# EAGLE design SCHEMAT_WYŚWIETLACZA (EAGLE 9.2.0)

## Sheet 1 of 2
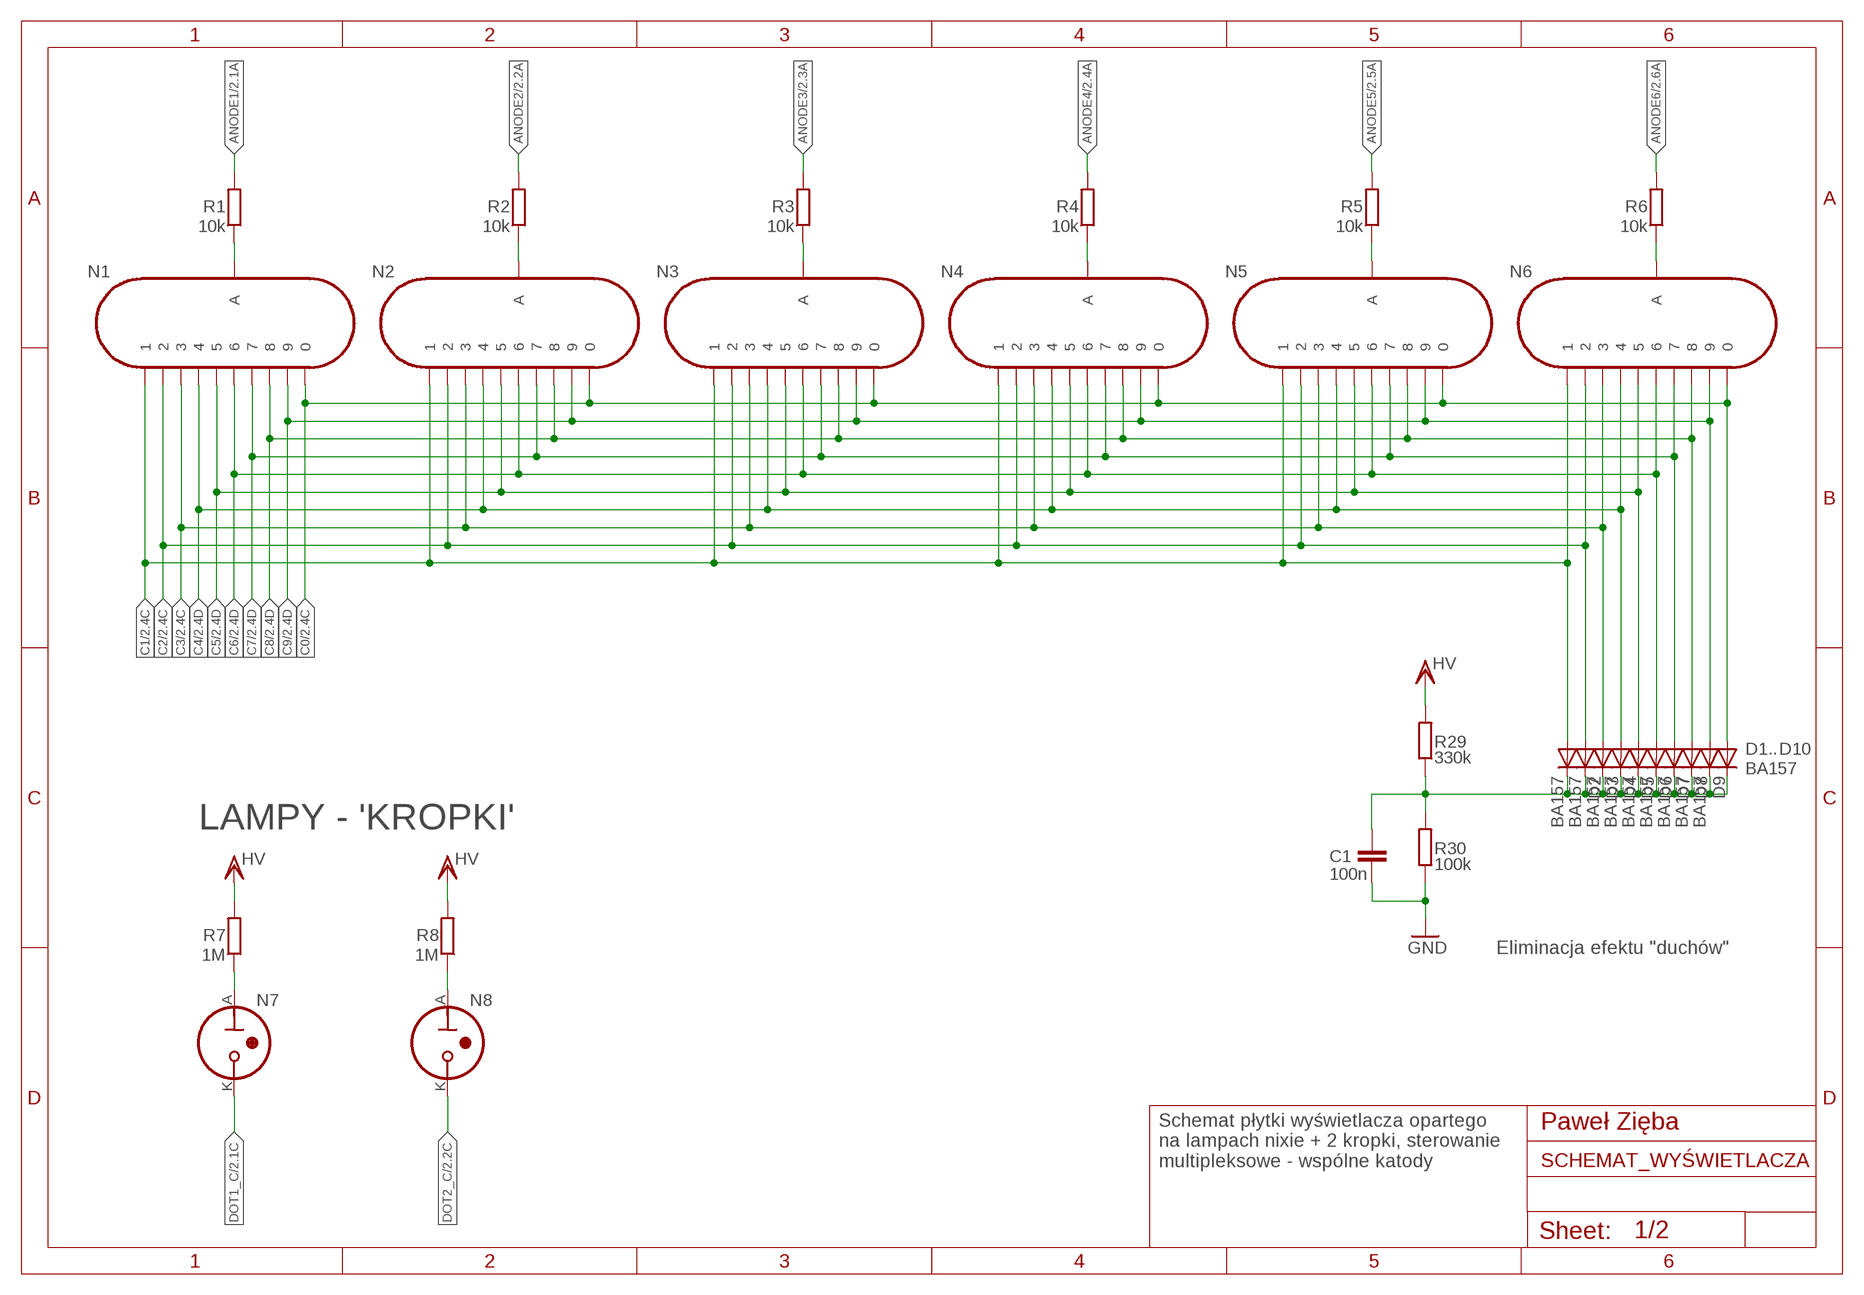
[diagram p0: schematic, sheet 1]

### Parts
C1  100n  C-EU050-045-075  [C50-45-75]
D1  BA157  [P1-10]
D2  BA157  [P1-10]
D3  BA157  [P1-10]
D4  BA157  [P1-10]
D5  BA157  [P1-10]
D6  BA157  [P1-10]
D7  BA157  [P1-10]
D8  BA157  [P1-10]
D9  BA157  [P1-10]
D10  BA157  [P1-10]
N1  IN-8  [IN-8]
N2  IN-8  [IN-8]
N3  IN-8  [IN-8]
N4  IN-8  [IN-8]
N5  IN-8  [IN-8]
N6  IN-8  [IN-8]
N7  IN-3  [IN-3]
N8  IN-3  [IN-3]
R1  10k  R-EU7  [204/7]
R2  10k  R-EU7  [204/7]
R3  10k  R-EU7  [204/7]
R4  10k  R-EU7  [204/7]
R5  10k  R-EU7  [204/7]
R6  10k  R-EU7  [204/7]
R7  1M  R-EU7  [204/7]
R8  1M  R-EU7  [204/7]
R29  330k  R-EU7  [204/7]
R30  100k  R-EU7  [204/7]

### Nets
ANODE1: R1.P$2 ; also sheet 2
ANODE2: R2.P$2 ; also sheet 2
ANODE3: R3.P$2 ; also sheet 2
ANODE4: R4.P$2 ; also sheet 2
ANODE5: R5.P$2 ; also sheet 2
ANODE6: R6.P$2 ; also sheet 2
C0: D10.A N1.0 N2.0 N3.0 N4.0 N5.0 N6.0 ; also sheet 2
C1: D1.A N1.1 N2.1 N3.1 N4.1 N5.1 N6.1 ; also sheet 2
C2: D2.A N1.2 N2.2 N3.2 N4.2 N5.2 N6.2 ; also sheet 2
C3: D3.A N1.3 N2.3 N3.3 N4.3 N5.3 N6.3 ; also sheet 2
C4: D4.A N1.4 N2.4 N3.4 N4.4 N5.4 N6.4 ; also sheet 2
C5: D5.A N1.5 N2.5 N3.5 N4.5 N5.5 N6.5 ; also sheet 2
C6: D6.A N1.6 N2.6 N3.6 N4.6 N5.6 N6.6 ; also sheet 2
C7: D7.A N1.7 N2.7 N3.7 N4.7 N5.7 N6.7 ; also sheet 2
C8: D8.A N1.8 N2.8 N3.8 N4.8 N5.8 N6.8 ; also sheet 2
C9: D9.A N1.9 N2.9 N3.9 N4.9 N5.9 N6.9 ; also sheet 2
DOT1_C: N7.K ; also sheet 2
DOT2_C: N8.K ; also sheet 2
GND: C1.P$2 R30.P$1 ; also sheet 2
HV: R7.P$2 R8.P$2 R29.P$2 ; also sheet 2
N$1: N7.A R7.P$1
N$2: N8.A R8.P$1
N$31: N1.A R1.P$1
N$32: C1.P$1 D1.C D2.C D3.C D4.C D5.C D6.C D7.C D8.C D9.C D10.C R29.P$1 R30.P$2
N$33: N2.A R2.P$1
N$34: N3.A R3.P$1
N$35: N5.A R5.P$1
N$36: N4.A R4.P$1
N$37: N6.A R6.P$1

### Notes on the sheet
- ..
- LAMPY - 'KROPKI'
- Eliminacja efektu "duchów"
- Paweł Zięba
- Schemat płytki wyświetlacza opartego 
  na lampach nixie + 2 kropki, sterowanie
  multipleksowe - wspólne katody

## Sheet 2 of 2
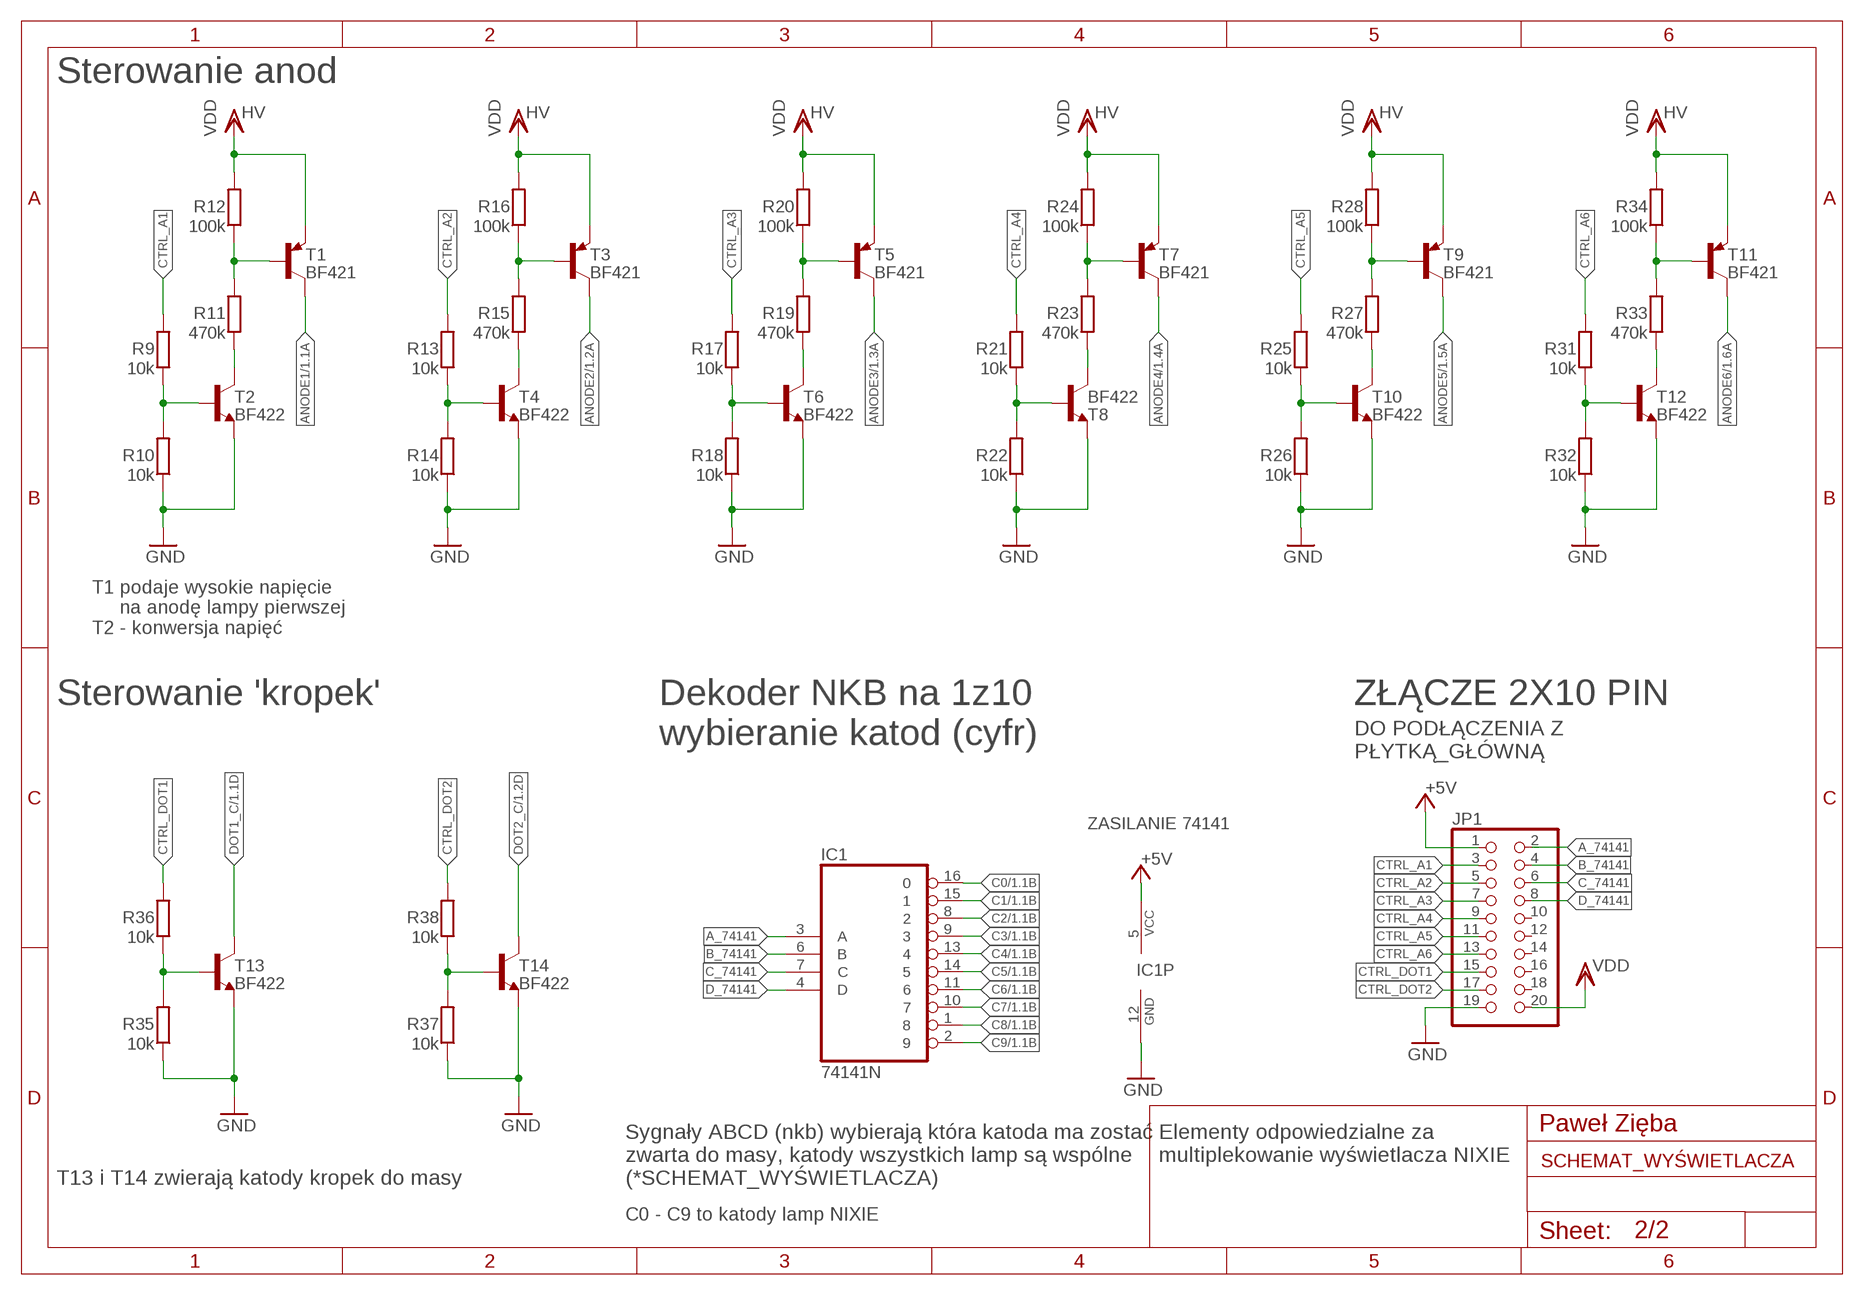
[diagram p1: schematic, sheet 2]

### Parts
IC1  74141N  [DIL16]
JP1  PINHD-2X10  [2X10]
R9  10k  R-EU7  [204/7]
R10  10k  R-EU7  [204/7]
R11  470k  R-EU7  [204/7]
R12  100k  R-EU7  [204/7]
R13  10k  R-EU7  [204/7]
R14  10k  R-EU7  [204/7]
R15  470k  R-EU7  [204/7]
R16  100k  R-EU7  [204/7]
R17  10k  R-EU7  [204/7]
R18  10k  R-EU7  [204/7]
R19  470k  R-EU7  [204/7]
R20  100k  R-EU7  [204/7]
R21  10k  R-EU7  [204/7]
R22  10k  R-EU7  [204/7]
R23  470k  R-EU7  [204/7]
R24  100k  R-EU7  [204/7]
R25  10k  R-EU7  [204/7]
R26  10k  R-EU7  [204/7]
R27  470k  R-EU7  [204/7]
R28  100k  R-EU7  [204/7]
R31  10k  R-EU7  [204/7]
R32  10k  R-EU7  [204/7]
R33  470k  R-EU7  [204/7]
R34  100k  R-EU7  [204/7]
R35  10k  R-EU7  [204/7]
R36  10k  R-EU7  [204/7]
R37  10k  R-EU7  [204/7]
R38  10k  R-EU7  [204/7]
T1  BF421  [TO92-BCE]
T2  BF422  BF422-NPN-TO92-BCE  [TO92-BCE]
T3  BF421  [TO92-BCE]
T4  BF422  BF422-NPN-TO92-BCE  [TO92-BCE]
T5  BF421  [TO92-BCE]
T6  BF422  BF422-NPN-TO92-BCE  [TO92-BCE]
T7  BF421  [TO92-BCE]
T8  BF422  BF422-NPN-TO92-BCE  [TO92-BCE]
T9  BF421  [TO92-BCE]
T10  BF422  BF422-NPN-TO92-BCE  [TO92-BCE]
T11  BF421  [TO92-BCE]
T12  BF422  BF422-NPN-TO92-BCE  [TO92-BCE]
T13  BF422  BF422-NPN-TO92-BCE  [TO92-BCE]
T14  BF422  BF422-NPN-TO92-BCE  [TO92-BCE]

### Nets
+5V: IC1.5(VCC) JP1.1
A_74141: IC1.3(A) JP1.2
ANODE1: T1.C ; also sheet 1
ANODE2: T3.C ; also sheet 1
ANODE3: T5.C ; also sheet 1
ANODE4: T7.C ; also sheet 1
ANODE5: T9.C ; also sheet 1
ANODE6: T11.C ; also sheet 1
B_74141: IC1.6(B) JP1.4
C0: IC1.16 ; also sheet 1
C1: IC1.15 ; also sheet 1
C2: IC1.8 ; also sheet 1
C3: IC1.9 ; also sheet 1
C4: IC1.13 ; also sheet 1
C5: IC1.14 ; also sheet 1
C6: IC1.11 ; also sheet 1
C7: IC1.10 ; also sheet 1
C8: IC1.1 ; also sheet 1
C9: IC1.2 ; also sheet 1
C_74141: IC1.7(C) JP1.6
CTRL_A1: JP1.3 R9.P$2
CTRL_A2: JP1.5 R13.P$2
CTRL_A3: JP1.7 R17.P$2
CTRL_A4: JP1.9 R21.P$2
CTRL_A5: JP1.11 R25.P$2
CTRL_A6: JP1.13 R31.P$2
CTRL_DOT1: JP1.15 R36.P$2
CTRL_DOT2: JP1.17 R38.P$2
D_74141: IC1.4(D) JP1.8
DOT1_C: T13.C ; also sheet 1
DOT2_C: T14.C ; also sheet 1
GND: IC1.12(GND) JP1.19 R10.P$1 R14.P$1 R18.P$1 R22.P$1 R26.P$1 R32.P$1 R35.P$1 R37.P$1 T2.E T4.E T6.E T8.E T10.E T12.E T13.E T14.E ; also sheet 1
HV: JP1.20 R12.P$2 R16.P$2 R20.P$2 R24.P$2 R28.P$2 R34.P$2 T1.E T3.E T5.E T7.E T9.E T11.E ; supply symbol labelled VDD ; also sheet 1
N$3: R9.P$1 R10.P$2 T2.B
N$4: R11.P$1 T2.C
N$5: R11.P$2 R12.P$1 T1.B
N$6: R13.P$1 R14.P$2 T4.B
N$7: R15.P$1 T4.C
N$8: R15.P$2 R16.P$1 T3.B
N$9: R17.P$1 R18.P$2 T6.B
N$10: R19.P$1 T6.C
N$11: R19.P$2 R20.P$1 T5.B
N$12: R21.P$1 R22.P$2 T8.B
N$13: R23.P$1 T8.C
N$14: R23.P$2 R24.P$1 T7.B
N$15: R25.P$1 R26.P$2 T10.B
N$16: R27.P$1 T10.C
N$17: R27.P$2 R28.P$1 T9.B
N$18: R31.P$1 R32.P$2 T12.B
N$19: R33.P$1 T12.C
N$20: R33.P$2 R34.P$1 T11.B
N$21: R35.P$2 R36.P$1 T13.B
N$22: R37.P$2 R38.P$1 T14.B
Unconnected: JP1.10 JP1.12 JP1.14 JP1.16 JP1.18

### Notes on the sheet
- Sterowanie anod
- T1 podaje wysokie napięcie 
       na anodę lampy pierwszej 
  T2 - konwersja napięć
- Dekoder NKB na 1z10
  wybieranie katod (cyfr)
- Sterowanie 'kropek' | ZŁĄCZE 2X10 PIN
- DO PODŁĄCZENIA Z
  PŁYTKĄ_GŁÓWNĄ
- ZASILANIE 74141
- Paweł Zięba
- T13 i T14 zwierają katody kropek do masy
- Sygnały ABCD (nkb) wybierają która katoda ma zostać 
  zwarta do masy, katody wszystkich lamp są wspólne
  (*SCHEMAT_WYŚWIETLACZA)
- Elementy odpowiedzialne za 
  multiplekowanie wyświetlacza NIXIE
- C0 - C9 to katody lamp NIXIE

## Library data of the parts
C1 = RCL!:C-EU
D1-D10 = diode:BA157: DIODE fast soft-recovery controlled avalanche rectifier
IC1 = 74xx-us:74*141: BCD to decimal DECODER/DRIVER
JP1 = pinhead:PINHD-2X10: PIN HEADER
N1-N6 = russian-nixies:IN-8: IN-8: medium numeric frontview nixie tube
N7 N8 = russian-nixies:IN-3: IN-3: nixie bulb
R1-R38 = RCL!:R-EU
T1 T3 T5 T7 T9 T11 = transistor-pnp:BF421*: PNP Transistror
T2 T4 T6 T8 T10 T12-T14 = transistor:*-NPN-: NPN Transistror BF959 corrected 2008.03.06

## Board
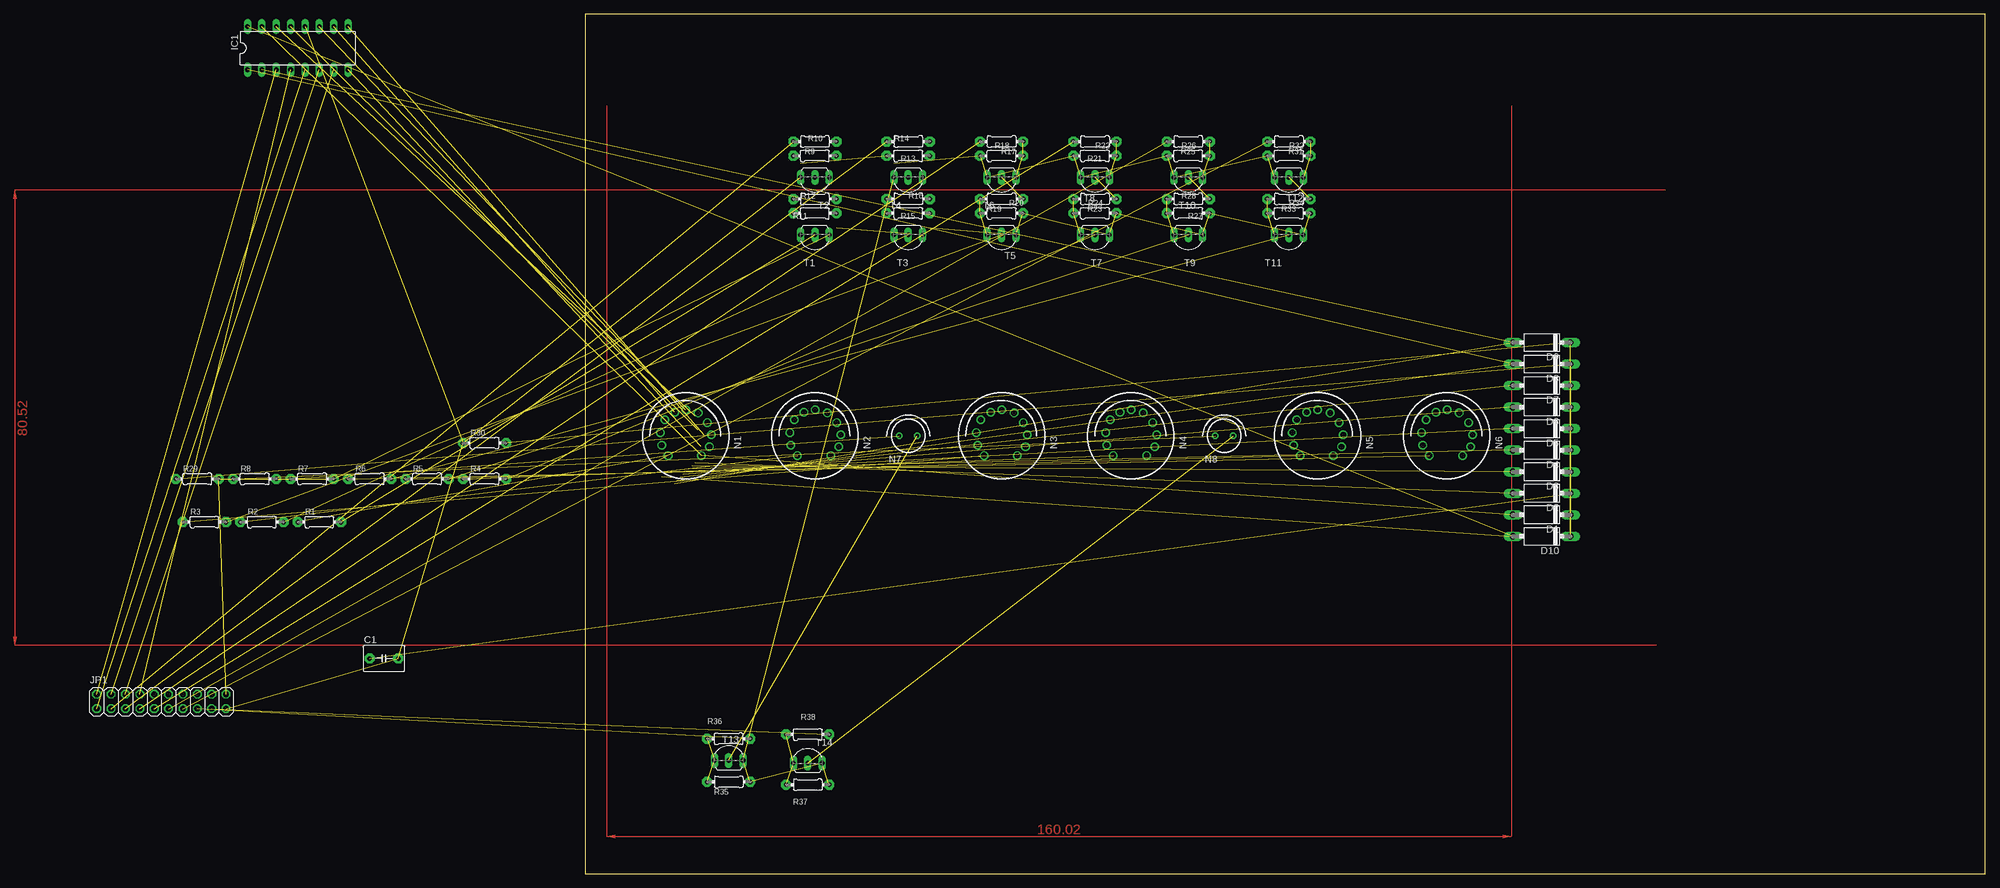
[diagram p2: board, top side]
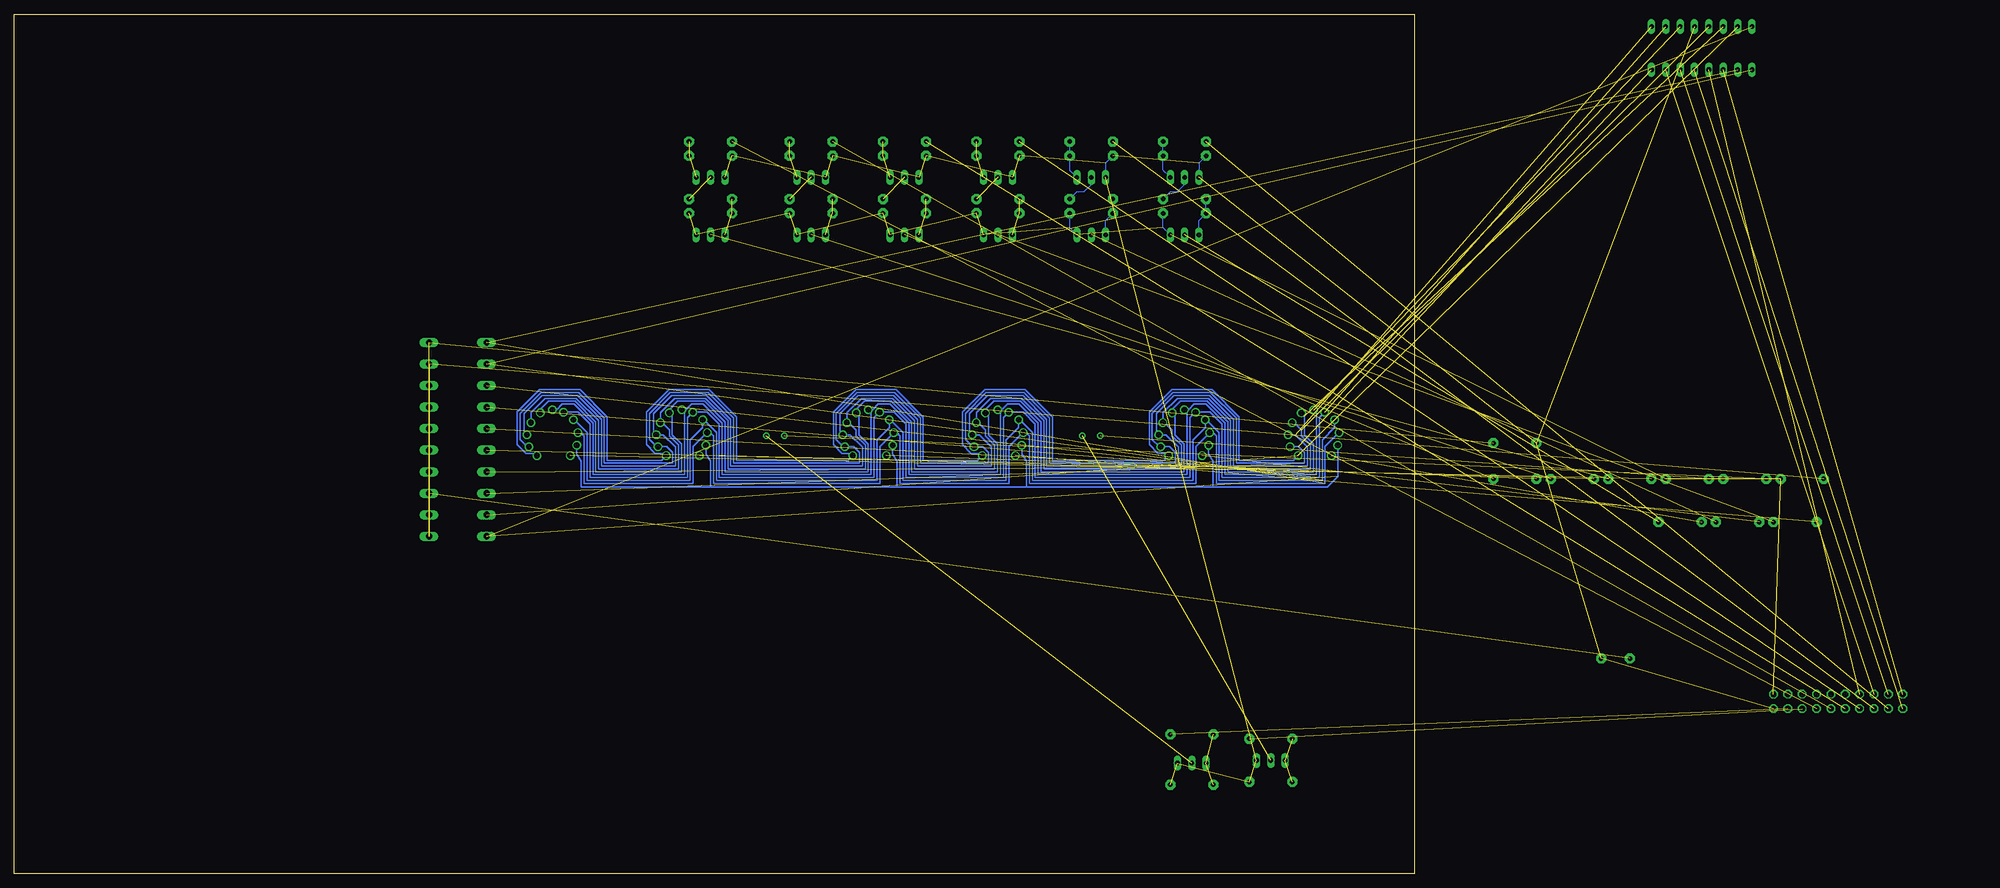
[diagram p3: board, bottom side, seen from below]

Size 247.63 x 152.07 mm. Coordinates in mm from the lower left corner, seen from the top.
Outline: 0,0 247.63,0 247.63,152.07 0,152.07 0,0
Copper layers (1*16): Top 0.035mm / dielectric 1.5mm / Bottom 0.035mm
Design rules "default *": minimum track width 6mil, minimum drill 0.35mm, track to track 8mil, track to pad 8mil, pad to pad 8mil, via to via 8mil, smd to smd 6mil, copper to edge 40mil, drill to drill 6mil, minimum pad ring 10mil, minimum via ring 8mil, stop-mask expansion 4mil, vias tented up to drill 0mil, thermal gap 10mil

### Footprints (pad centres in the part's own frame; a part is rotated, then mirrored left to right if it is on the bottom)
C50-45-75 = drill 0.8 pad 1.778 octagon: P$1 -2.54,0; P$2 2.54,0
P1-10 = drill 1.118 long: A 5.08,0; C -5.08,0
DIL16 = drill 0.813 long: 1 -8.89,-3.81; 2 -6.35,-3.81; 3 -3.81,-3.81; 4 -1.27,-3.81; 5 1.27,-3.81; 6 3.81,-3.81; 7 6.35,-3.81; 8 8.89,-3.81; 9 8.89,3.81; 10 6.35,3.81; 11 3.81,3.81; 12 1.27,3.81; 13 -1.27,3.81; 14 -3.81,3.81; 15 -6.35,3.81; 16 -8.89,3.81
2X10 = drill 1.016 octagon: 1 -11.43,-1.27; 2 -11.43,1.27; 3 -8.89,-1.27; 4 -8.89,1.27; 5 -6.35,-1.27; 6 -6.35,1.27; 7 -3.81,-1.27; 8 -3.81,1.27; 9 -1.27,-1.27; 10 -1.27,1.27; 11 1.27,-1.27; 12 1.27,1.27; 13 3.81,-1.27; 14 3.81,1.27; 15 6.35,-1.27; 16 6.35,1.27; 17 8.89,-1.27; 18 8.89,1.27; 19 11.43,-1.27; 20 11.43,1.27
IN-8 = drill 1: 0 -4.244,-1.655; 1 2.792,-3.483; 2 4.222,-1.907; 3 4.556,0.189; 4 3.837,2.348; 5 2.203,4.052; 6 0.034,4.603; 7 -1.928,4.186; 8 -3.666,2.83; 9 -4.461,0.584; A -3.101,-3.49
IN-3 = drill 0.6 octagon: A -1.587,0; K 1.587,0
204/7 = drill 0.8 pad 1.778 octagon: P$1 -3.81,0; P$2 3.81,0
TO92-BCE = drill 0.813 long: B 2.54,0; C 0,0; E -2.54,0
TO92-BCE' = drill 0.813 long: B -2.54,0; C 0,0; E 2.54,0

### Placement (x,y rotation side)
C1  -35.56,38.1 0 top  (outside the outline)
D1  169.16,63.5 180 top
D2  169.16,67.31 180 top
D3  169.16,71.12 180 top
D4  169.16,74.93 180 top
D5  169.16,78.74 180 top
D6  169.16,82.55 180 top
D7  169.16,86.36 180 top
D8  169.16,90.17 180 top
D9  169.16,93.98 180 top
D10  169.16,59.69 180 top
IC1  -50.8,146.05 0 top  (outside the outline)
JP1  -74.93,30.48 0 top  (outside the outline)
N1  17.78,77.47 0 top
N2  40.64,77.47 0 top
N3  73.66,77.47 0 top
N4  96.52,77.47 0 top
N5  129.54,77.47 0 top
N6  152.4,77.47 0 top
N7  57.15,77.47 0 top
N8  113.03,77.47 0 top
R1  -46.99,62.23 0 top  (outside the outline)
R2  -57.15,62.23 0 top  (outside the outline)
R3  -67.31,62.23 0 top  (outside the outline)
R4  -17.78,69.85 0 top  (outside the outline)
R5  -27.94,69.85 0 top  (outside the outline)
R6  -38.1,69.85 0 top  (outside the outline)
R7  -48.26,69.85 0 top  (outside the outline)
R8  -58.42,69.85 0 top  (outside the outline)
R9  40.64,129.54 180 top
R10  40.64,127 0 top
R11  40.64,119.38 180 top
R12  40.64,116.84 0 top
R13  57.15,129.54 180 top
R14  57.15,127 0 top
R15  57.15,119.38 180 top
R16  57.15,116.84 0 top
R17  73.66,129.54 180 top
R18  73.66,127 0 top
R19  73.66,119.38 180 top
R20  73.66,116.84 0 top
R21  90.17,129.54 180 top
R22  90.17,127 0 top
R23  90.17,119.38 180 top
R24  90.17,116.84 0 top
R25  106.68,129.54 180 top
R26  106.68,127 0 top
R27  106.68,119.38 180 top
R28  106.68,116.84 0 top
R29  -68.58,69.85 0 top  (outside the outline)
R30  -17.78,76.2 0 top  (outside the outline)
R31  124.46,129.54 180 top
R32  124.46,127 0 top
R33  124.46,119.38 180 top
R34  124.46,116.84 0 top
R35  25.4,16.26 180 top
R36  25.4,23.88 0 top
R37  39.37,15.75 180 top
R38  39.37,24.64 0 top
T1  40.64,113.03 180 top
T2  BF422  [TO92-BCE']  40.64,123.19 180 top
T3  57.15,113.03 180 top
T4  BF422  [TO92-BCE']  57.15,123.19 180 top
T5  73.66,113.03 180 top
T6  BF422  [TO92-BCE']  73.66,123.19 180 top
T7  90.17,113.03 180 top
T8  BF422  [TO92-BCE']  90.17,123.19 180 top
T9  106.68,113.03 180 top
T10  BF422  [TO92-BCE']  106.68,123.19 180 top
T11  124.46,113.03 180 top
T12  BF422  [TO92-BCE']  124.46,123.19 180 top
T13  BF422  [TO92-BCE']  25.4,20.07 0 top
T14  BF422  [TO92-BCE']  39.37,19.56 0 top

### Tracks (layer width: path | path; a pad name or v marks a point on that pad's centre or on a via)
+5V  (1 unrouted)
A_74141  (1 unrouted)
ANODE1  (1 unrouted)
ANODE2  (1 unrouted)
ANODE3  (1 unrouted)
ANODE4  (1 unrouted)
ANODE5  (1 unrouted)
ANODE6  (1 unrouted)
B_74141  (1 unrouted)
C0  (2 unrouted)
  Bottom 0.305: 35.6,68.45 35.6,73.03 36.4,74.26 | 36.4,74.26 N2.0 | 35.6,68.45 15.37,68.45 13.51,70.31 13.51,75.79 N1.0 | 91.48,68.45 91.48,73.03 92.28,74.26 N4.0 | 91.48,68.45 68.62,68.45 | 69.39,75.79 N3.0 69.42,74.26 68.62,73.03 68.62,68.45 | N6.0 148.16,74.26 147.36,73.03 147.36,68.45 124.5,68.45 | 125.27,75.79 N5.0 125.3,74.26 124.5,73.03 124.5,68.45 | 68.62,68.45 35.6,68.45 | 36.4,74.26 36.37,74.23 36.37,74.22 36.36,74.2 | 91.48,68.45 124.5,68.45
C1  (2 unrouted)
  Bottom 0.305: N1.1 21.41,73.15 30.99,73.15 30.99,80.8 35.82,85.63 42.91,85.63 46.88,81.66 46.88,75.92 45.35,74.38 43.83,74.38 N2.1 44.27,73.15 64.01,73.15 64.01,80.8 68.84,85.63 75.93,85.63 79.91,81.66 79.91,75.92 78.37,74.38 76.85,74.38 N3.1 77.29,73.15 86.87,73.15 86.87,80.8 91.7,85.63 98.79,85.63 102.77,81.66 102.77,75.92 101.23,74.38 99.71,74.38 N4.1 100.15,73.15 119.89,73.15 119.89,80.8 124.72,85.63 131.81,85.63 135.78,81.66 135.78,75.92 134.25,74.38 132.73,74.38 N5.1 133.17,73.15 142.75,73.15 142.75,80.8 147.58,85.63 154.67,85.63 158.65,81.66 158.65,75.92 157.11,74.38 155.59,74.38 N6.1
C2  (2 unrouted)
  Bottom 0.305: N1.2 20.48,75.56 19.43,74.52 19.43,72.64 31.5,72.64 31.5,80.59 36.03,85.12 42.7,85.12 46.38,81.44 46.38,76.81 45.13,75.56 N2.2 43.34,75.56 42.29,74.52 42.29,72.64 64.52,72.64 64.52,80.59 69.05,85.12 75.72,85.12 79.4,81.44 79.4,76.81 78.15,75.56 N3.2 76.36,75.56 75.31,74.52 75.31,72.64 87.38,72.64 87.38,80.59 91.91,85.12 98.58,85.12 102.26,81.44 102.26,76.81 101.01,75.56 N4.2 99.22,75.56 98.17,74.52 98.17,72.64 120.4,72.64 120.4,80.59 124.93,85.12 131.6,85.12 135.28,81.44 135.28,76.81 134.03,75.56 N5.2 132.24,75.56 131.19,74.52 131.19,72.64 143.26,72.64 143.26,80.59 147.79,85.12 154.46,85.12 158.14,81.44 158.14,76.81 156.89,75.56 N6.2
C3  (2 unrouted)
  Bottom 0.305: N1.3 21.07,77.66 18.9,75.49 18.9,72.14 32,72.14 32,80.38 36.24,84.61 42.49,84.61 45.66,81.44 45.66,78.12 N2.3 43.93,77.66 41.76,75.49 41.76,72.14 65.02,72.14 65.02,80.38 69.26,84.61 75.51,84.61 78.68,81.44 78.68,78.12 N3.3 76.95,77.66 74.78,75.49 74.78,72.14 87.88,72.14 87.88,80.38 92.12,84.61 98.37,84.61 101.54,81.44 101.54,78.12 N4.3 99.81,77.66 97.64,75.49 97.64,72.14 120.9,72.14 120.9,80.38 125.14,84.61 131.39,84.61 134.56,81.44 134.56,78.12 N5.3 132.83,77.66 130.66,75.49 130.66,72.14 143.76,72.14 143.76,80.38 148,84.61 154.25,84.61 157.42,81.44 157.42,78.12 N6.3
C4  (2 unrouted)
  Bottom 0.305: N1.4 21.32,79.82 19.98,78.48 19.98,77.43 18.36,75.81 18.36,71.63 32.51,71.63 32.51,80.17 36.45,84.11 41.93,84.11 44.45,81.58 44.45,79.84 N2.4 44.18,79.82 42.84,78.48 42.84,77.43 41.22,75.81 41.22,71.63 65.53,71.63 65.53,80.17 69.47,84.11 74.95,84.11 77.47,81.58 77.47,79.84 N3.4 77.2,79.82 75.86,78.48 75.86,77.43 74.24,75.81 74.24,71.63 88.39,71.63 88.39,80.17 92.33,84.11 97.81,84.11 100.33,81.58 100.33,79.84 N4.4 100.06,79.82 98.72,78.48 98.72,77.43 97.1,75.81 97.1,71.63 121.41,71.63 121.41,80.17 125.35,84.11 130.83,84.11 133.35,81.58 133.35,79.84 N5.4 133.08,79.82 131.74,78.48 131.74,77.43 130.12,75.81 130.12,71.63 144.27,71.63 144.27,80.17 148.21,84.11 153.69,84.11 156.21,81.58 156.21,79.84 N6.4
C5  (2 unrouted)
  Bottom 0.305: N1.5 19.48,81.01 19.48,77.64 17.86,76.02 17.86,71.12 33.02,71.12 33.02,79.96 36.66,83.6 41.37,83.6 42.84,82.12 N2.5 42.34,81.01 42.34,77.64 40.72,76.02 40.72,71.12 66.04,71.12 66.04,79.96 69.68,83.6 74.39,83.6 75.86,82.12 N3.5 75.36,81.01 75.36,77.64 73.74,76.02 73.74,71.12 88.9,71.12 88.9,79.96 92.54,83.6 97.25,83.6 98.72,82.12 N4.5 98.22,81.01 98.22,77.64 96.6,76.02 96.6,71.12 121.92,71.12 121.92,79.96 125.56,83.6 130.27,83.6 131.74,82.12 N5.5 131.24,81.01 131.24,77.64 129.62,76.02 129.62,71.12 144.78,71.12 144.78,79.96 148.42,83.6 153.13,83.6 154.6,82.12 N6.5
C6  (2 unrouted)
  Bottom 0.305: N1.6 17.33,81.59 17.33,70.61 33.53,70.61 33.53,79.75 36.87,83.09 38.95,83.09 39.96,82.07 N2.6 40.19,81.59 40.19,70.61 66.55,70.61 66.55,79.75 69.89,83.09 71.97,83.09 72.98,82.07 N3.6 73.21,81.59 73.21,70.61 89.41,70.61 89.41,79.75 92.75,83.09 94.83,83.09 95.84,82.07 N4.6 96.07,81.59 96.07,70.61 122.43,70.61 122.43,79.75 125.77,83.09 127.85,83.09 128.86,82.07 N5.6 129.09,81.59 129.09,70.61 145.29,70.61 145.29,79.75 148.63,83.09 150.71,83.09 151.72,82.07 N6.6
C7  (2 unrouted)
  Bottom 0.305: N1.7 16.82,80.69 16.82,70.1 34.04,70.1 34.04,79.54 36.15,81.66 N2.7 39.67,80.69 39.67,70.1 67.06,70.1 67.06,79.54 69.17,81.66 N3.7 72.69,80.69 72.69,70.1 89.92,70.1 89.92,79.54 92.03,81.66 N4.7 95.56,80.69 95.56,70.1 122.94,70.1 122.94,79.54 125.05,81.66 N5.7 128.57,80.69 128.57,70.1 145.8,70.1 145.8,79.54 147.91,81.66 N6.7
C8  (2 unrouted)
  Bottom 0.305: N1.8 14.11,78.93 16.31,76.74 16.31,69.6 34.54,69.6 34.54,78.09 36.76,80.3 N2.8 36.97,78.93 39.17,76.74 39.17,69.6 67.56,69.6 67.56,78.09 69.78,80.3 N3.8 69.99,78.93 72.19,76.74 72.19,69.6 90.42,69.6 90.42,78.09 92.64,80.3 N4.8 92.85,78.93 95.05,76.74 95.05,69.6 123.44,69.6 123.44,78.09 125.66,80.3 N5.8 125.87,78.93 128.07,76.74 128.07,69.6 146.3,69.6 146.3,78.09 148.52,80.3 N6.8
C9  (2 unrouted)
  Bottom 0.305: N1.9 15.8,75.57 15.8,69.04 35.05,69.04 35.05,77.47 35.64,78.05 N2.9 38.66,75.57 38.66,69.04 68.07,69.04 68.07,77.47 68.66,78.05 N3.9 71.68,75.57 71.68,69.04 90.93,69.04 90.93,77.47 91.52,78.05 N4.9 94.54,75.57 94.54,69.04 123.95,69.04 123.95,77.47 124.54,78.05 N5.9 127.56,75.57 127.56,69.04 146.81,69.04 146.81,77.47 147.4,78.05 N6.9
C_74141  (1 unrouted)
CTRL_A1  (1 unrouted)
CTRL_A2  (1 unrouted)
CTRL_A3  (1 unrouted)
CTRL_A4  (1 unrouted)
CTRL_A5  (1 unrouted)
CTRL_A6  (1 unrouted)
CTRL_DOT1  (1 unrouted)
CTRL_DOT2  (1 unrouted)
D_74141  (1 unrouted)
DOT1_C  (1 unrouted)
DOT2_C  (1 unrouted)
GND  (17 unrouted)
  Bottom 0.152: R10.P$1 38.1,125.73 T2.E | R14.P$1 54.61,125.73 T4.E
HV  (13 unrouted)
  Bottom 0.152: T1.E 44.45,114.3 R12.P$2 | R16.P$2 60.96,114.3 T3.E
N$1  (1 unrouted)
N$2  (1 unrouted)
N$3
  Bottom 0.152: T2.B 44.45,124.46 R10.P$2 R9.P$1
N$4
  Bottom 0.152: R11.P$1 43.18,120.65 41.91,120.65 40.64,121.92 T2.C
N$5
  Bottom 0.152: T1.B 38.1,115.57 R12.P$1 R11.P$2
N$6
  Bottom 0.152: R13.P$1 R14.P$2 60.96,124.46 T4.B
N$7
  Bottom 0.152: R15.P$1 59.69,120.65 58.42,120.65 57.15,121.92 T4.C
N$8
  Bottom 0.152: T3.B 54.61,115.57 R16.P$1 R15.P$2
N$9  (2 unrouted)
N$10  (1 unrouted)
N$11  (2 unrouted)
N$12  (2 unrouted)
N$13  (1 unrouted)
N$14  (2 unrouted)
N$15  (2 unrouted)
N$16  (1 unrouted)
N$17  (2 unrouted)
N$18  (2 unrouted)
N$19  (1 unrouted)
N$20  (2 unrouted)
N$21  (2 unrouted)
N$22  (2 unrouted)
N$31  (1 unrouted)
N$32  (12 unrouted)
N$33  (1 unrouted)
N$34  (1 unrouted)
N$35  (1 unrouted)
N$36  (1 unrouted)
N$37  (1 unrouted)
(copper drawn outside any net)
  shapes: Top area x2